# EAGLE schematic MOD-v2-1 (EAGLE 8.2.2)
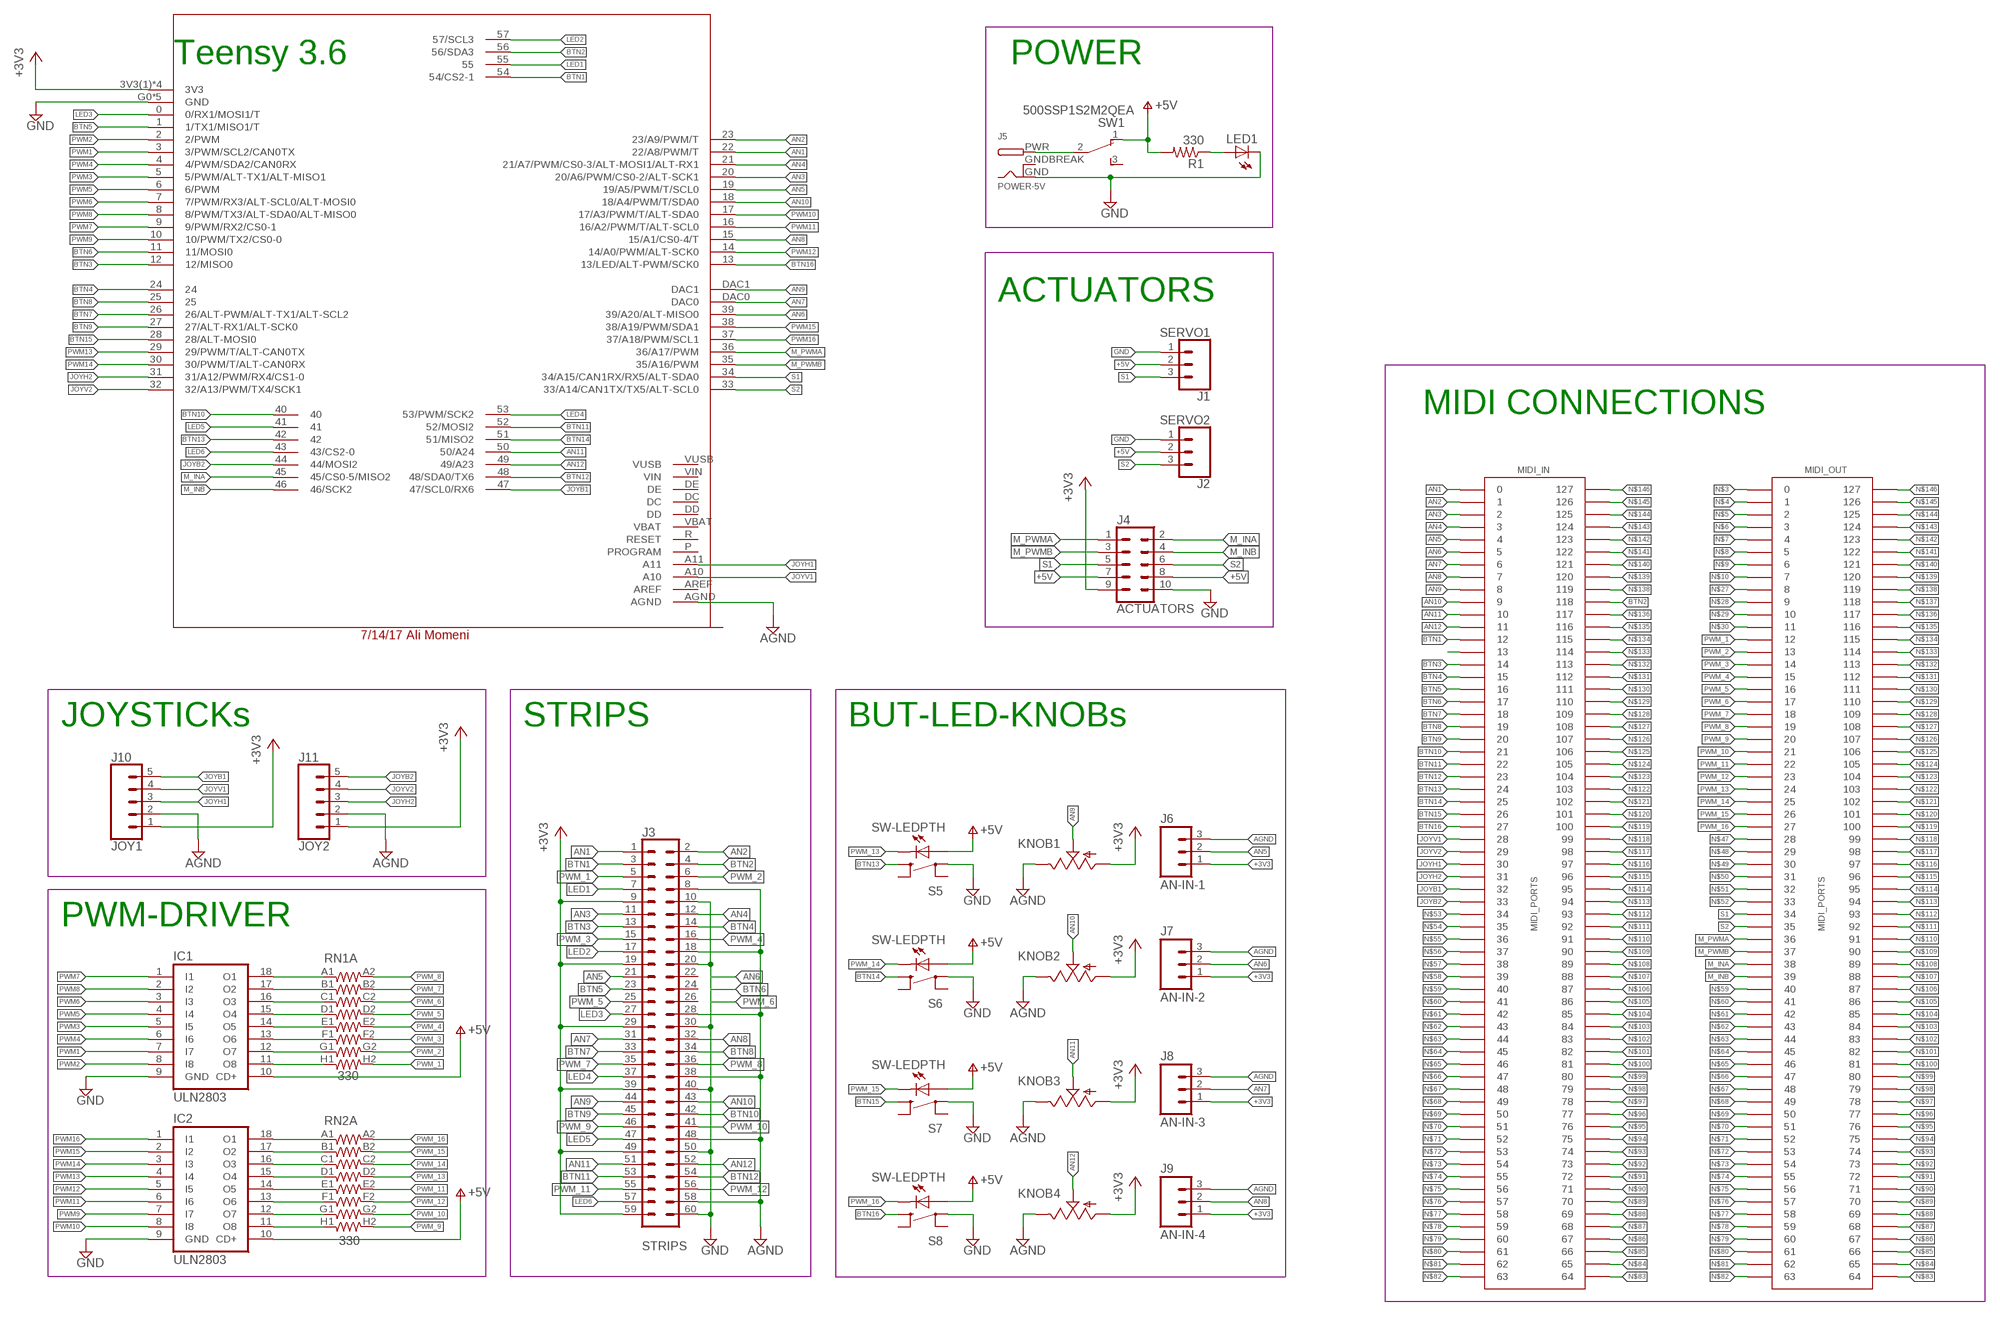
[diagram p0: schematic, sheet 1]

## Parts
IC1  ULN2803  ULN2803A  [DIL18]
IC2  ULN2803  ULN2803A  [DIL18]
J1  SERVO1  CONN_03LOCK  [1X03_LOCK@1]
J2  SERVO2  CONN_03LOCK  [1X03_LOCK@1]
J3  STRIPS  CONN_30X2  [2X30_SHROUDED]
J4  ACTUATORS  CONN_05X2SHD_LOCK  [2X5-SHROUDED_LOCK]
J5  POWER-5V  DCBARRELPTH  [DCJACK_2MM_PTH]
J6  AN-IN-1  M031X03_NO_SILK  [1X03_NO_SILK]
J7  AN-IN-2  M031X03_NO_SILK  [1X03_NO_SILK]
J8  AN-IN-3  M031X03_NO_SILK  [1X03_NO_SILK]
J9  AN-IN-4  M031X03_NO_SILK  [1X03_NO_SILK]
J10  JOY1  CONN_05LOCK  [1X05_LOCK]
J11  JOY2  CONN_05LOCK  [1X05_LOCK]
KNOB1  TRIM  [TRIM-PCB-9MM]
KNOB2  TRIM  [TRIM-PCB-9MM]
KNOB3  TRIM  [TRIM-PCB-9MM]
KNOB4  TRIM  [TRIM-PCB-9MM]
LED1  LED3MM  [LED3MM]
MIDI_IN  MIDI_PORTS  (no package)
MIDI_OUT  MIDI_PORTS  (no package)
R1  330  R-US_0204/7  [0204/7]
RN1  330  RESISTOR-NET-8PDIL16  [RESISTOR-NET-8P-DIL16]
RN2  330  RESISTOR-NET-8PDIL16  [RESISTOR-NET-8P-DIL16]
S5  SW-LEDPTH  [TR2-SWITCH-MOMENTARY-LED]
S6  SW-LEDPTH  [TR2-SWITCH-MOMENTARY-LED]
S7  SW-LEDPTH  [TR2-SWITCH-MOMENTARY-LED]
S8  SW-LEDPTH  [TR2-SWITCH-MOMENTARY-LED]
SW1  500SSP1S2M2QEA  SWITCH_SPDT500SSP1S2M2QEA  [SWITCH_SPDT_500SSP1S2M2QEA]
TEENSY  TEENSY3_6-ALI_NO-USB-HOST  [TEENSY3-6_NO-USB-HOST]

## Nets
+3V3: J3.9 J3.19 J3.29 J3.39 J3.49 J3.59 J4.9 J6.1 J7.1 J8.1 J9.1 J10.1 J11.1 KNOB1.1(A) KNOB2.1(A) KNOB3.1(A) KNOB4.1(A) TEENSY.3V3(1)(3V3) TEENSY.3V3(2)(3V3) TEENSY.3V3(3)(3V3) TEENSY.3V3(4)(3V3)
+5V [Power]: IC1.10(CD+) IC2.10(CD+) J1.2 J2.2 J4.7 J4.8 R1.2 SW1.1 ; supply symbol labelled V+
AGND [Analog Sig]: J3.8 J3.18 J3.28 J3.38 J3.48 J3.58 J6.3 J7.3 J8.3 J9.3 J10.2 J11.2 KNOB1.3(E) KNOB2.3(E) KNOB3.3(E) KNOB4.3(E) TEENSY.AGND
AN1 [Analog Sig]: J3.1 MIDI_IN.0 TEENSY.22(22/A8/PWM/T)
AN2 [Analog Sig]: J3.2 MIDI_IN.1 TEENSY.23(23/A9/PWM/T)
AN3 [Analog Sig]: J3.11 MIDI_IN.2 TEENSY.20(20/A6/PWM/CS0-2/ALT-SCK1)
AN4 [Analog Sig]: J3.12 MIDI_IN.3 TEENSY.21(21/A7/PWM/CS0-3/ALT-MOSI1/ALT-RX1)
AN5 [Analog Sig]: J3.21 J6.2 MIDI_IN.4 TEENSY.19(19/A5/PWM/T/SCL0)
AN6 [Analog Sig]: J7.2 MIDI_IN.5 TEENSY.39(39/A20/ALT-MISO0)
AN7 [Analog Sig]: J3.31 J8.2 MIDI_IN.6 TEENSY.DAC0
AN8 [Analog Sig]: J3.32 J9.2 MIDI_IN.7 TEENSY.15(15/A1/CS0-4/T)
AN9 [Analog Sig]: J3.44 KNOB1.2(S) MIDI_IN.8 TEENSY.DAC1
AN10 [Analog Sig]: J3.43 KNOB2.2(S) MIDI_IN.9 TEENSY.18(18/A4/PWM/T/SDA0)
AN11 [Analog Sig]: J3.51 KNOB3.2(S) MIDI_IN.10 TEENSY.50(50/A24)
AN12 [Analog Sig]: J3.52 KNOB4.2(S) MIDI_IN.11 TEENSY.49(49/A23)
BTN1: J3.3 MIDI_IN.12 TEENSY.54(54/CS2-1)
BTN2: J3.4 MIDI_IN.118 TEENSY.56(56/SDA3)
BTN3: J3.13 MIDI_IN.14 TEENSY.12(12/MISO0)
BTN4: J3.14 MIDI_IN.15 TEENSY.24
BTN5: J3.23 MIDI_IN.16 TEENSY.1(1/TX1/MISO1/T)
BTN6: MIDI_IN.17 TEENSY.11(11/MOSI0)
BTN7: J3.33 MIDI_IN.18 TEENSY.26(26/ALT-PWM/ALT-TX1/ALT-SCL2)
BTN8: J3.34 MIDI_IN.19 TEENSY.25
BTN9: J3.45 MIDI_IN.20 TEENSY.27(27/ALT-RX1/ALT-SCK0)
BTN10: J3.42 MIDI_IN.21 TEENSY.40
BTN11: J3.53 MIDI_IN.22 TEENSY.52(52/MOSI2)
BTN12: J3.54 MIDI_IN.23 TEENSY.48(48/SDA0/TX6)
BTN13: MIDI_IN.24 S5.1 TEENSY.42
BTN14: MIDI_IN.25 S6.1 TEENSY.51(51/MISO2)
BTN15: MIDI_IN.26 S7.1 TEENSY.28(28/ALT-MOSI0)
BTN16: MIDI_IN.27 S8.1 TEENSY.13(13/LED/ALT-PWM/SCK0)
GND: IC1.9(GND) IC2.9(GND) J1.1 J2.1 J3.10 J3.20 J3.30 J3.40 J3.50 J3.60 J4.10 J5.GND LED1.K(C) S5.3 S6.3 S7.3 S8.3 TEENSY.G0(GND) TEENSY.G1(GND) TEENSY.G2(GND) TEENSY.G3(GND) TEENSY.G6(GND)
JOYB1: J10.5 MIDI_IN.32 TEENSY.47(47/SCL0/RX6)
JOYB2: J11.5 MIDI_IN.33 TEENSY.44(44/MOSI2)
JOYH1 [Analog Sig]: J10.3 MIDI_IN.30 TEENSY.A11
JOYH2 [Analog Sig]: J11.3 MIDI_IN.31 TEENSY.31(31/A12/PWM/RX4/CS1-0)
JOYV1 [Analog Sig]: J10.4 MIDI_IN.28 TEENSY.A10
JOYV2 [Analog Sig]: J11.4 MIDI_IN.29 TEENSY.32(32/A13/PWM/TX4/SCK1)
LED1: J3.7 TEENSY.55
LED2: J3.17 TEENSY.57(57/SCL3)
LED3: J3.27 TEENSY.0(0/RX1/MOSI1/T)
LED4: J3.37 TEENSY.53(53/PWM/SCK2)
LED5: J3.47 TEENSY.41
LED6: J3.57 TEENSY.43(43/CS2-0)
M_INA: J4.2 MIDI_OUT.38 TEENSY.45(45/CS0-5/MISO2)
M_INB: J4.4 MIDI_OUT.39 TEENSY.46(46/SCK2)
M_PWMA: J4.1 MIDI_OUT.36 TEENSY.36(36/A17/PWM)
M_PWMB: J4.3 MIDI_OUT.37 TEENSY.35(35/A16/PWM)
N$1: J5.PWR SW1.2
N$2: LED1.A R1.1
N$3: MIDI_OUT.0
N$4: MIDI_OUT.1
N$5: MIDI_OUT.2
N$6: MIDI_OUT.3
N$7: MIDI_OUT.4
N$8: MIDI_OUT.5
N$9: MIDI_OUT.6
N$10: MIDI_OUT.7
N$11: IC1.18(O1) RN1.A1
N$12: IC1.17(O2) RN1.B1
N$13: IC1.16(O3) RN1.C1
N$14: IC1.15(O4) RN1.D1
N$15: IC1.14(O5) RN1.E1
N$16: IC1.13(O6) RN1.F1
N$17: IC1.12(O7) RN1.G1
N$18: IC1.11(O8) RN1.H1
N$19: IC2.18(O1) RN2.A1
N$20: IC2.17(O2) RN2.B1
N$21: IC2.16(O3) RN2.C1
N$22: IC2.15(O4) RN2.D1
N$23: IC2.14(O5) RN2.E1
N$24: IC2.12(O7) RN2.G1
N$25: IC2.11(O8) RN2.H1
N$26: IC2.13(O6) RN2.F1
N$27: MIDI_OUT.8
N$28: MIDI_OUT.9
N$29: MIDI_OUT.10
N$30: MIDI_OUT.11
N$31: MIDI_IN.13
N$47: MIDI_OUT.28
N$48: MIDI_OUT.29
N$49: MIDI_OUT.30
N$50: MIDI_OUT.31
N$51: MIDI_OUT.32
N$52: MIDI_OUT.33
N$53: MIDI_IN.34
N$54: MIDI_IN.35
N$55: MIDI_IN.36
N$56: MIDI_IN.37
N$57: MIDI_IN.38
N$58: MIDI_IN.39
N$59: MIDI_IN.40 MIDI_OUT.40
N$60: MIDI_IN.41 MIDI_OUT.41
N$61: MIDI_IN.42 MIDI_OUT.42
N$62: MIDI_IN.43 MIDI_OUT.43
N$63: MIDI_IN.44 MIDI_OUT.44
N$64: MIDI_IN.45 MIDI_OUT.45
N$65: MIDI_IN.46 MIDI_OUT.46
N$66: MIDI_IN.47 MIDI_OUT.47
N$67: MIDI_IN.48 MIDI_OUT.48
N$68: MIDI_IN.49 MIDI_OUT.49
N$69: MIDI_IN.50 MIDI_OUT.50
N$70: MIDI_IN.51 MIDI_OUT.51
N$71: MIDI_IN.52 MIDI_OUT.52
N$72: MIDI_IN.53 MIDI_OUT.53
N$73: MIDI_IN.54 MIDI_OUT.54
N$74: MIDI_IN.55 MIDI_OUT.55
N$75: MIDI_IN.56 MIDI_OUT.56
N$76: MIDI_IN.57 MIDI_OUT.57
N$77: MIDI_IN.58 MIDI_OUT.58
N$78: MIDI_IN.59 MIDI_OUT.59
N$79: MIDI_IN.60 MIDI_OUT.60
N$80: MIDI_IN.61 MIDI_OUT.61
N$81: MIDI_IN.62 MIDI_OUT.62
N$82: MIDI_IN.63 MIDI_OUT.63
N$83: MIDI_IN.64 MIDI_OUT.64
N$84: MIDI_IN.65 MIDI_OUT.65
N$85: MIDI_IN.66 MIDI_OUT.66
N$86: MIDI_IN.67 MIDI_OUT.67
N$87: MIDI_IN.68 MIDI_OUT.68
N$88: MIDI_IN.69 MIDI_OUT.69
N$89: MIDI_IN.70 MIDI_OUT.70
N$90: MIDI_IN.71 MIDI_OUT.71
N$91: MIDI_IN.72 MIDI_OUT.72
N$92: MIDI_IN.73 MIDI_OUT.73
N$93: MIDI_IN.74 MIDI_OUT.74
N$94: MIDI_IN.75 MIDI_OUT.75
N$95: MIDI_IN.76 MIDI_OUT.76
N$96: MIDI_IN.77 MIDI_OUT.77
N$97: MIDI_IN.78 MIDI_OUT.78
N$98: MIDI_IN.79 MIDI_OUT.79
N$99: MIDI_IN.80 MIDI_OUT.80
N$100: MIDI_IN.81 MIDI_OUT.81
N$101: MIDI_IN.82 MIDI_OUT.82
N$102: MIDI_IN.83 MIDI_OUT.83
N$103: MIDI_IN.84 MIDI_OUT.84
N$104: MIDI_IN.85 MIDI_OUT.85
N$105: MIDI_IN.86 MIDI_OUT.86
N$106: MIDI_IN.87 MIDI_OUT.87
N$107: MIDI_IN.88 MIDI_OUT.88
N$108: MIDI_IN.89 MIDI_OUT.89
N$109: MIDI_IN.90 MIDI_OUT.90
N$110: MIDI_IN.91 MIDI_OUT.91
N$111: MIDI_IN.92 MIDI_OUT.92
N$112: MIDI_IN.93 MIDI_OUT.93
N$113: MIDI_IN.94 MIDI_OUT.94
N$114: MIDI_IN.95 MIDI_OUT.95
N$115: MIDI_IN.96 MIDI_OUT.96
N$116: MIDI_IN.97 MIDI_OUT.97
N$117: MIDI_IN.98 MIDI_OUT.98
N$118: MIDI_IN.99 MIDI_OUT.99
N$119: MIDI_IN.100 MIDI_OUT.100
N$120: MIDI_IN.101 MIDI_OUT.101
N$121: MIDI_IN.102 MIDI_OUT.102
N$122: MIDI_IN.103 MIDI_OUT.103
N$123: MIDI_IN.104 MIDI_OUT.104
N$124: MIDI_IN.105 MIDI_OUT.105
N$125: MIDI_IN.106 MIDI_OUT.106
N$126: MIDI_IN.107 MIDI_OUT.107
N$127: MIDI_IN.108 MIDI_OUT.108
N$128: MIDI_IN.109 MIDI_OUT.109
N$129: MIDI_IN.110 MIDI_OUT.110
N$130: MIDI_IN.111 MIDI_OUT.111
N$131: MIDI_IN.112 MIDI_OUT.112
N$132: MIDI_IN.113 MIDI_OUT.113
N$133: MIDI_IN.114 MIDI_OUT.114
N$134: MIDI_IN.115 MIDI_OUT.115
N$135: MIDI_IN.116 MIDI_OUT.116
N$136: MIDI_IN.117 MIDI_OUT.117
N$137: MIDI_OUT.118
N$138: MIDI_IN.119 MIDI_OUT.119
N$139: MIDI_IN.120 MIDI_OUT.120
N$140: MIDI_IN.121 MIDI_OUT.121
N$141: MIDI_IN.122 MIDI_OUT.122
N$142: MIDI_IN.123 MIDI_OUT.123
N$143: MIDI_IN.124 MIDI_OUT.124
N$144: MIDI_IN.125 MIDI_OUT.125
N$145: MIDI_IN.126 MIDI_OUT.126
N$146: MIDI_IN.127 MIDI_OUT.127
PWM1: IC1.7(I7) TEENSY.3(3/PWM/SCL2/CAN0TX)
PWM2: IC1.8(I8) TEENSY.2(2/PWM)
PWM3: IC1.5(I5) TEENSY.5(5/PWM/ALT-TX1/ALT-MISO1)
PWM4: IC1.6(I6) TEENSY.4(4/PWM/SDA2/CAN0RX)
PWM5: IC1.4(I4) TEENSY.6(6/PWM)
PWM6: IC1.3(I3) TEENSY.7(7/PWM/RX3/ALT-SCL0/ALT-MOSI0)
PWM7: IC1.1(I1) TEENSY.9(9/PWM/RX2/CS0-1)
PWM8: IC1.2(I2) TEENSY.8(8/PWM/TX3/ALT-SDA0/ALT-MISO0)
PWM9: IC2.7(I7) TEENSY.10(10/PWM/TX2/CS0-0)
PWM10: IC2.8(I8) TEENSY.17(17/A3/PWM/T/ALT-SDA0)
PWM11: IC2.6(I6) TEENSY.16(16/A2/PWM/T/ALT-SCL0)
PWM12: IC2.5(I5) TEENSY.14(14/A0/PWM/ALT-SCK0)
PWM13: IC2.4(I4) TEENSY.29(29/PWM/T/ALT-CAN0TX)
PWM14: IC2.3(I3) TEENSY.30(30/PWM/T/ALT-CAN0RX)
PWM15: IC2.2(I2) TEENSY.38(38/A19/PWM/SDA1)
PWM16: IC2.1(I1) TEENSY.37(37/A18/PWM/SCL1)
PWM_1: J3.5 MIDI_OUT.12 RN1.H2
PWM_2: J3.6 MIDI_OUT.13 RN1.G2
PWM_3: J3.15 MIDI_OUT.14 RN1.F2
PWM_4: J3.16 MIDI_OUT.15 RN1.E2
PWM_5: J3.25 MIDI_OUT.16 RN1.D2
PWM_6: MIDI_OUT.17 RN1.C2
PWM_7: J3.35 MIDI_OUT.18 RN1.B2
PWM_8: J3.36 MIDI_OUT.19 RN1.A2
PWM_9: J3.46 MIDI_OUT.20 RN2.H2
PWM_10: J3.41 MIDI_OUT.21 RN2.G2
PWM_11: J3.55 MIDI_OUT.22 RN2.E2
PWM_12: J3.56 MIDI_OUT.23 RN2.F2
PWM_13: MIDI_OUT.24 RN2.D2 S5.C
PWM_14: MIDI_OUT.25 RN2.C2 S6.C
PWM_15: MIDI_OUT.26 RN2.B2 S7.C
PWM_16: MIDI_OUT.27 RN2.A2 S8.C
S1: J1.3 J4.5 MIDI_OUT.34 TEENSY.34(34/A15/CAN1RX/RX5/ALT-SDA0)
S2: J2.3 J4.6 MIDI_OUT.35 TEENSY.33(33/A14/CAN1TX/TX5/ALT-SCL0)
V+: S5.A S6.A S7.A S8.A
Unconnected: J3.22 J3.24 J3.26 S5.2 S5.4 S6.2 S6.4 S7.2 S7.4 S8.2 S8.4 SW1.3 TEENSY.AREF TEENSY.DC TEENSY.DD TEENSY.DE TEENSY.P(PROGRAM) TEENSY.R(RESET) TEENSY.VBAT TEENSY.VIN TEENSY.VUSB

## Notes on the sheet
- Teensy 3.6 | POWER
- ACTUATORS
- MIDI CONNECTIONS
- JOYSTICKs | STRIPS | BUT-LED-KNOBs
- PWM-DRIVER

## Power pins joined to a net without a drawn wire
GNDBREAK: J5.GNDBREAK

## Library data of the parts
IC1 IC2 = uln-udn:ULN2803A: DRIVER ARRAY
J1 J2 = SparkFun-Connectors:CONN_03: Multi connection point. Often used as Generic Header-pin footprint for 0.1 inch spaced/style header connections On any of the 0.1 inch spaced packages, you can populate with these: Break Away Headers - Straight <https://www.sparkfun.com/products/116> (PRT-00116) Break Away Male Headers - Right Angle <https://www.sparkfun.com/products/553> (PRT-00553) Female Headers <https://www.sparkfun.com/products/115> (PRT-00115) Break Away Headers - Machine Pin <https://www.sparkfun.com/products/117> (PRT-00117) Break Away Female Headers - Swiss Machine Pin <https://www.sparkfun.com/products/743> (PRT-00743) Stackable Header - 3 Pin (Female, 0.1") <https://www.sparkfun.com/products/13875> (PRT-13875) For SCREWTERMINALS and SPRING TERMINALS visit here: Screw Terimnals on SparkFun.com <https://www.sparkfun.com/search/results?term=Screw+Terminals> (5mm/3.5mm/2.54mm spacing) This device is also useful as a general connection point to wire up your design to another part of your project. Our various solder wires solder well into these plated through hole pads. Hook-Up Wire - Assortment (Stranded, 22 AWG) <https://www.sparkfun.com/products/11375> (PRT-11375) Hook-Up Wire - Assortment (Solid Core, 22 AWG) <https://www.sparkfun.com/products/11367> (PRT-11367) View the entire wire category on our website here <https://www.sparkfun.com/categories/141> Special notes: Molex polarized connector foot print use with SKU : PRT-08232 with associated crimp pins and housings.
J3 = CMU-ArtFab:CONN_30X2
J4 = SparkFun-Connectors:CONN_05X2: Multi connection point. Often used as Generic Header-pin footprint for 0.1 inch spaced/style header connections For AVR SPI programming port, see special device with nice symbol: "AVR_SPI_PROG_5x2.dev" You can populate with any combo of single row headers, but if you'd like an exact match, check these: 2x5 AVR ICSP Male Header <https://www.sparkfun.com/products/778> (PRT-00778) 2x5 Pin Shrouded Header <https://www.sparkfun.com/products/8506> (PRT-08506) On any of the 0.1 inch spaced packages, you can populate with these: Break Away Headers - Straight <https://www.sparkfun.com/products/116> (PRT-00116) Break Away Male Headers - Right Angle <https://www.sparkfun.com/products/553> (PRT-00553) Female Headers <https://www.sparkfun.com/products/115> (PRT-00115) Break Away Headers - Machine Pin <https://www.sparkfun.com/products/117> (PRT-00117) Break Away Female Headers - Swiss Machine Pin <https://www.sparkfun.com/products/743> (PRT-00743) Special note: the shrouded connector mates well with our 5x2 ribbon cables: 2x5 Pin IDC Ribbon Cable <https://www.sparkfun.com/products/8535> (PRT-08535); PROD_ID: CONN-08671; SF_ID: PRT-08506
J5 = adafruit:DCBARREL: 2.0mm DC Barrel Jack DCJACK_2MM_PTH - Through Hole Jack (4UConnector: 05537)
J6-J9 = SparkFun-Connectors:M03: Header 3 Standard 3-pin 0.1" header. Use with straight break away headers (SKU : PRT-00116), right angle break away headers (PRT-00553), swiss pins (PRT-00743), machine pins (PRT-00117), and female headers (PRT-00115). Molex polarized connector foot print use with SKU : PRT-08232 with associated crimp pins and housings.
J10 J11 = SparkFun-Connectors:CONN_05: Multi connection point. Often used as Generic Header-pin footprint for 0.1 inch spaced/style header connections On any of the 0.1 inch spaced packages, you can populate with these: Break Away Headers - Straight <https://www.sparkfun.com/products/116> (PRT-00116) Break Away Male Headers - Right Angle <https://www.sparkfun.com/products/553> (PRT-00553) Female Headers <https://www.sparkfun.com/products/115> (PRT-00115) Break Away Headers - Machine Pin <https://www.sparkfun.com/products/117> (PRT-00117) Break Away Female Headers - Swiss Machine Pin <https://www.sparkfun.com/products/743> (PRT-00743) For SCREWTERMINALS and SPRING TERMINALS visit here: Screw Terimnals on SparkFun.com <https://www.sparkfun.com/search/results?term=Screw+Terminals> (5mm/3.5mm/2.54mm spacing) This device is also useful as a general connection point to wire up your design to another part of your project. Our various solder wires solder well into these plated through hole pads. Hook-Up Wire - Assortment (Stranded, 22 AWG) <https://www.sparkfun.com/products/11375> (PRT-11375) Hook-Up Wire - Assortment (Solid Core, 22 AWG) <https://www.sparkfun.com/products/11367> (PRT-11367) View the entire wire category on our website here <https://www.sparkfun.com/categories/141> Special notes: Molex polarized connector foot print use with SKU : PRT-08231 with associated crimp pins and housings. 1MM SMD Version SKU: PRT-10208
KNOB1-KNOB4 = CMU-ArtFab:TRIM
LED1 = led:LED: LED OSRAM: - CHIPLED LG R971, LG N971, LY N971, LG Q971, LY Q971, LO R971, LY R971 LH N974, LH R974 LS Q976, LO Q976, LY Q976 LO Q996 - Hyper CHIPLED LW Q18S LB Q993, LB Q99A, LB R99A - SideLED LS A670, LO A670, LY A670, LG A670, LP A670 LB A673, LV A673, LT A673, LW A673 LH A674 LY A675 LS A676, LA A676, LO A676, LY A676, LW A676 LS A679, LY A679, LG A679 - Hyper Micro SIDELED® LS Y876, LA Y876, LO Y876, LY Y876 LT Y87S - SmartLED LW L88C, LW L88S LB L89C, LB L89S, LG L890 LS L89K, LO L89K, LY L89K LS L896, LA L896, LO L896, LY L896 - TOPLED LS T670, LO T670, LY T670, LG T670, LP T670 LSG T670, LSP T670, LSY T670, LOP T670, LYG T670 LG T671, LOG T671, LSG T671 LB T673, LV T673, LT T673, LW T673 LH T674 LS T676, LA T676, LO T676, LY T676, LB T676, LH T676, LSB T676, LW T676 LB T67C, LV T67C, LT T67C, LS T67K, LO T67K, LY T67K, LW E67C LS E67B, LA E67B, LO E67B, LY E67B, LB E67C, LV E67C, LT E67C LW T67C LS T679, LY T679, LG T679 LS T770, LO T770, LY T770, LG T770, LP T770 LB T773, LV T773, LT T773, LW T773 LH T774 LS E675, LA E675, LY E675, LS T675 LS T776, LA T776, LO T776, LY T776, LB T776 LHGB T686 LT T68C, LB T68C - Hyper Mini TOPLED® LB M676 - Mini TOPLED Santana® LG M470 LS M47K, LO M47K, LY M47K Source: http://www.osram.convergy.de LUXEON: - LUMILED® LXK2-PW12-R00, LXK2-PW12-S00, LXK2-PW14-U00, LXK2-PW14-V00 LXK2-PM12-R00, LXK2-PM12-S00, LXK2-PM14-U00 LXK2-PE12-Q00, LXK2-PE12-R00, LXK2-PE12-S00, LXK2-PE14-T00, LXK2-PE14-U00 LXK2-PB12-K00, LXK2-PB12-L00, LXK2-PB12-M00, LXK2-PB14-N00, LXK2-PB14-P00, LXK2-PB14-Q00 LXK2-PR12-L00, LXK2-PR12-M00, LXK2-PR14-Q00, LXK2-PR14-R00 LXK2-PD12-Q00, LXK2-PD12-R00, LXK2-PD12-S00 LXK2-PH12-R00, LXK2-PH12-S00 LXK2-PL12-P00, LXK2-PL12-Q00, LXK2-PL12-R00 Source: www.luxeon.com KINGBRIGHT: KA-3528ASYC Source: www.kingbright.com
MIDI_IN MIDI_OUT = CMU-ArtFab:MIDI_PORTS
R1 = resistor:R-US_: RESISTOR, American symbol
RN1 RN2 = CMU-ArtFab:RESISTOR-NET-8P: CTS 742 Series 16 Terminations, 8 Resistors
S5-S8 = Daniel:SW-LED: SWITCH PUSH SPST-NO 10MA 12V
SW1 = CMU-ArtFab:SWITCH_SPDT; DIGIKEY: EG5137-ND
TEENSY = CMU-ArtFab:TEENSY3_6-ALI_NO-USB-HOST

## Net classes
2 Power: width 0.381 mm, clearance 0.279 mm
3 Analog Sig: width 0.381 mm, clearance 0.279 mm